# EAGLE schematic OnOnfre_DevBoard_rev4 (EAGLE 9.2.2)
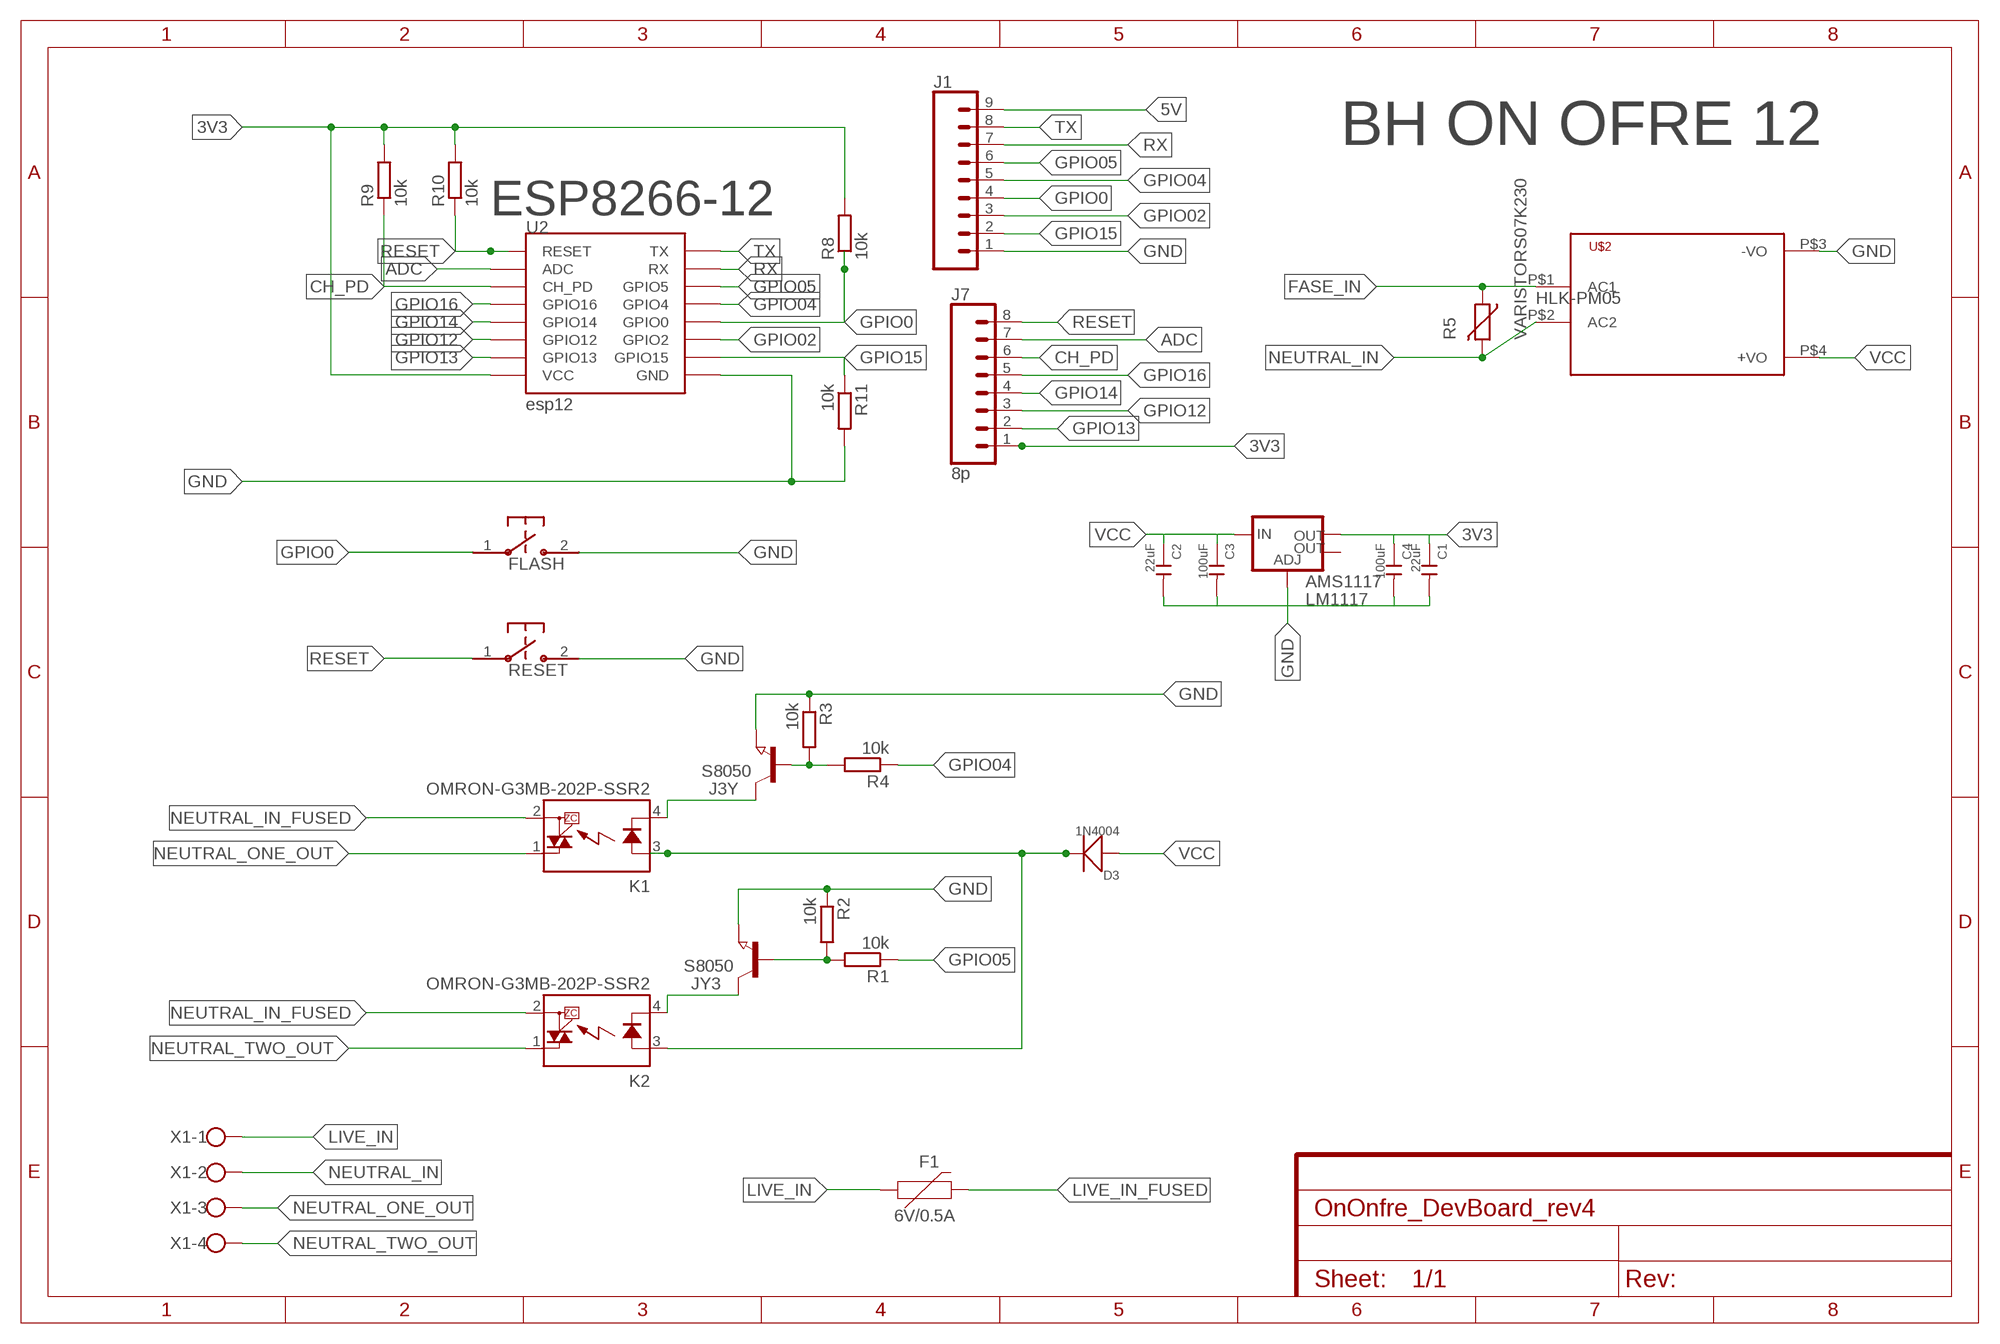
[diagram p0: schematic, sheet 1]

## Parts
AMS1117  LM1117  V_REG_LM1117SOT223  [SOT223]
C1  22uF  CERAMIC-1NF-1KV-10%-X7R(1206)  [C1206]
C2  22uF  CERAMIC-1NF-1KV-10%-X7R(1206)  [C1206]
C3  100uF  CERAMIC-1NF-1KV-10%-X7R(1206)  [C1206]
C4  100uF  CERAMIC-1NF-1KV-10%-X7R(1206)  [C1206]
D3  1N4004  DIODE-GEN-PURPOSE-1KV-1A(DO-214AC)  [DO-214AC]
F1  6V/0.5A  PPTC_HALF-AMP  [1206]
FLASH  B3U-1000P-2P-SMD  B3U-1000P  [B3U-1000P]
J1  CONN_09  [1X09]
J3Y  S8050  NPN-TRANSISTOR_SOT23  [SOT23]
J7  8p  CONN_08"  [1X08]
JY3  S8050  NPN-TRANSISTOR_SOT23  [SOT23]
K1  OMRON-G3MB-202P-SSR2  [OMRON-G3MB-202P-SSR]
K2  OMRON-G3MB-202P-SSR2  [OMRON-G3MB-202P-SSR]
R1  10k  R-EU_R0603  [R0603]
R2  10k  R-EU_R0603  [R0603]
R3  10k  R-EU_R0603  [R0603]
R4  10k  R-EU_R0603  [R0603]
R5  VARISTORS07K230  [S07K230]
R8  10k  R-EU_R0603  [R0603]
R9  10k  R-EU_R0603  [R0603]
R10  10k  R-EU_R0603  [R0603]
R11  10k  R-EU_R0603  [R0603]
RESET  B3U-1000P-2P-SMD  B3U-1000P  [B3U-1000P]
U2  esp12  ESP12SMD  [ESP12-SMD]
U$2  HKLPM01  [HKLPM01]
X1  W237-4  [W237-4]

## Nets
3V3: AMS1117.2(OUT) C1.1 C4.1 J7.1 R8.2 R9.2 R10.2 U2.VCC
5V: D3.2(-) J1.9 K1.3(A) K2.3(A)
ADC: J7.7 U2.ADC
CH_PD: J7.6 R9.1 U2.CH_PD
FASE_IN [220V]: R5.1 U$2.P$1(AC1)
GND: AMS1117.1(ADJ) C1.2 C2.2 C3.2 C4.2 FLASH.2 J1.1 J3Y.2(E) JY3.2(E) R2.1 R3.1 R11.2 RESET.2 U2.GND U$2.P$3(-VO)
GPIO0: FLASH.1 J1.4 R8.1 U2.GPIO0
GPIO02: J1.3 U2.GPIO2
GPIO04: J1.5 R4.1 U2.GPIO4
GPIO05: J1.6 R1.1 U2.GPIO5
GPIO12: J7.3 U2.GPIO12
GPIO13: J7.2 U2.GPIO13
GPIO14: J7.4 U2.GPIO14
GPIO15: J1.2 R11.1 U2.GPIO15
GPIO16: J7.5 U2.GPIO16
LIVE_IN [220V]: F1.1 X1.1
LIVE_IN_FUSED: F1.2
N$1: J3Y.3(C) K1.4(K)
N$7: J3Y.1(B) R3.2 R4.2
N$9: JY3.3(C) K2.4(K)
N$13: JY3.1(B) R1.2 R2.2
NEUTRAL_IN [220V]: R5.2 U$2.P$2(AC2) X1.2
NEUTRAL_IN_FUSED: K1.2(DS2) K2.2(DS2)
NEUTRAL_ONE_OUT [220V]: K1.1(DS1) X1.3
NEUTRAL_TWO_OUT [220V]: K2.1(DS1) X1.4
RESET: J7.8 R10.1 RESET.1 U2.RESET
RX: J1.7 U2.RXD0(RX)
TX: J1.8 U2.TXD0(TX)
VCC: AMS1117.3(IN) C2.1 C3.1 D3.1(+) U$2.P$4(+VO)
Unconnected: AMS1117.4(OUT)

## Notes on the sheet
- BH ON OFRE 12
- ESP8266-12
- HLK-PM05

## Library data of the parts
AMS1117 = SparkFun-IC-Power:V_REG_LM1117: Voltage Regulator LM1117 Standard adjustable voltage regulator but in SMD form. Spark Fun Electronics SKU : COM-00595; PROD_ID: VREG-08170
C1-C4 = Seeed-Capacitor:CERAMIC-1NF-1KV-10%-X7R?(1206): 302010189; MPN: CC1206KKX7RCBB102; VALUE: 1NF
D3 = Seeed-Diode:DIODE-GEN-PURPOSE-1KV-1A(DO-214AC): 304010013; MPN: 1N4007; VALUE: 1N4007
F1 = SparkFun-Fuses:PPTC: Resettable Fuse PPTC Resettable Fuse. Really a sort of resistor with a polymeric positive temperature coefficient whose resistance increases dramatically with an increase in temperature. When heated by the power passing through the resistance rises causing the current to be limited, protecting the circuit. This is achieved by the transition of the polymer from a crystalline to an amorphous state where the conductive carbon separates breaking the conductive pathways found in the cool crystalline structure. When a PPTC cools back down it resumes conducting letting the circuit turn back on. SparkFun Products: SparkFun RedBoard - Programmed with Arduino <https://www.sparkfun.com/products/12757> Pro Micro - 5V/16MHz <https://www.sparkfun.com/products/12640> Arduino Pro 328 - 5V/16MHz <https://www.sparkfun.com/products/10915> MP3 Trigger <https://www.sparkfun.com/products/13720>; PROD_ID: RES-08585
FLASH RESET = switches:B3U: Switch; DIGIKEY: SW1020CT-ND; MANUFACTURER: Omron; MPN: B3U-1000P
J1 = SparkFun-Connectors:CONN_09: Multi connection point. Often used as Generic Header-pin footprint for 0.1 inch spaced/style header connections On any of the 0.1 inch spaced packages, you can populate with these: Break Away Headers - Straight <https://www.sparkfun.com/products/116> (PRT-00116) Break Away Male Headers - Right Angle <https://www.sparkfun.com/products/553> (PRT-00553) Female Headers <https://www.sparkfun.com/products/115> (PRT-00115) Break Away Headers - Machine Pin <https://www.sparkfun.com/products/117> (PRT-00117) Break Away Female Headers - Swiss Machine Pin <https://www.sparkfun.com/products/743> (PRT-00743) For SCREWTERMINALS and SPRING TERMINALS visit here: Screw Terimnals on SparkFun.com <https://www.sparkfun.com/search/results?term=Screw+Terminals> (5mm/3.5mm/2.54mm spacing) This device is also useful as a general connection point to wire up your design to another part of your project. Our various solder wires solder well into these plated through hole pads. Hook-Up Wire - Assortment (Stranded, 22 AWG) <https://www.sparkfun.com/products/11375> (PRT-11375) Hook-Up Wire - Assortment (Solid Core, 22 AWG) <https://www.sparkfun.com/products/11367> (PRT-11367) View the entire wire category on our website here <https://www.sparkfun.com/categories/141> Special notes: Molex polarized connector foot print use with SKU : PRT-08231 with associated crimp pins and housings. 1MM SMD Version SKU: PRT-10208 NOTES ON THE VARIANTS LOCK and LOCK_LONGPADS... This footprint was designed to help hold the alignment of a through-hole component (i.e. 6-pin header) while soldering it into place. You may notice that each hole has been shifted either up or down by 0.005 of an inch from it's more standard position (which is a perfectly straight line). This slight alteration caused the pins (the squares in the middle) to touch the edges of the holes. Because they are alternating, it causes a "brace" to hold the component in place. 0.005 has proven to be the perfect amount of "off-center" position when using our standard breakaway headers. Although looks a little odd when you look at the bare footprint, once you have a header in there, the alteration is very hard to notice. Also,if you push a header all the way into place, it is covered up entirely on the bottom side.
J3Y JY3 = semicon-smd-ipc:NPN-TRANSISTOR_: NPN TRANSISTOR
J7 = SparkFun-Connectors:CONN_08: Multi connection point. Often used as Generic Header-pin footprint for 0.1 inch spaced/style header connections On any of the 0.1 inch spaced packages, you can populate with these: Break Away Headers - Straight <https://www.sparkfun.com/products/116> (PRT-00116) Break Away Male Headers - Right Angle <https://www.sparkfun.com/products/553> (PRT-00553) Female Headers <https://www.sparkfun.com/products/115> (PRT-00115) Break Away Headers - Machine Pin <https://www.sparkfun.com/products/117> (PRT-00117) Break Away Female Headers - Swiss Machine Pin <https://www.sparkfun.com/products/743> (PRT-00743) Arduino Stackable Header - 8 Pin <https://www.sparkfun.com/products/9279> (PRT-09279) For SCREWTERMINALS and SPRING TERMINALS visit here: Screw Terimnals on SparkFun.com <https://www.sparkfun.com/search/results?term=Screw+Terminals> (5mm/3.5mm/2.54mm spacing) This device is also useful as a general connection point to wire up your design to another part of your project. Our various solder wires solder well into these plated through hole pads. Hook-Up Wire - Assortment (Stranded, 22 AWG) <https://www.sparkfun.com/products/11375> (PRT-11375) Hook-Up Wire - Assortment (Solid Core, 22 AWG) <https://www.sparkfun.com/products/11367> (PRT-11367) View the entire wire category on our website here <https://www.sparkfun.com/categories/141> Special notes: Molex polarized connector foot print use with SKU : PRT-08231 with associated crimp pins and housings. 1MM SMD Version SKU: PRT-10208 NOTES ON THE VARIANTS LOCK and LOCK_LONGPADS... This footprint was designed to help hold the alignment of a through-hole component (i.e. 6-pin header) while soldering it into place. You may notice that each hole has been shifted either up or down by 0.005 of an inch from it's more standard position (which is a perfectly straight line). This slight alteration caused the pins (the squares in the middle) to touch the edges of the holes. Because they are alternating, it causes a "brace" to hold the component in place. 0.005 has proven to be the perfect amount of "off-center" position when using our standard breakaway headers. Although looks a little odd when you look at the bare footprint, once you have a header in there, the alteration is very hard to notice. Also,if you push a header all the way into place, it is covered up entirely on the bottom side.; PROD_ID: CONN-08438
K1 K2 = Omron G3MB 202p SSR:OMRON-G3MB-202P-SSR: IT(rms) 8A, Zero Cross type SIP 4pin Triac output SSR Source: http://sharp-world.com/products/device/lineup/data/pdf/datasheet/s102s02_e.pdf; MPN: S202S02F; OC_FARNELL: 1618475; OC_NEWARK: 14N9588
R1-R4 R8-R11 = resistor:R-EU_: RESISTOR, European symbol
R5 = varistor:VARISTOR: VARISTOR
U2 = esp8266modules:ESP12: ESP8266 Wifi module 12
U$2 = HKLPM01:HKLPM01
X1 = con-wago-500:W237-4: WAGO SCREW CLAMP; OC_FARNELL: unknown; OC_NEWARK: unknown

## Net classes
1 220V: width 1.27 mm, clearance 2 mm